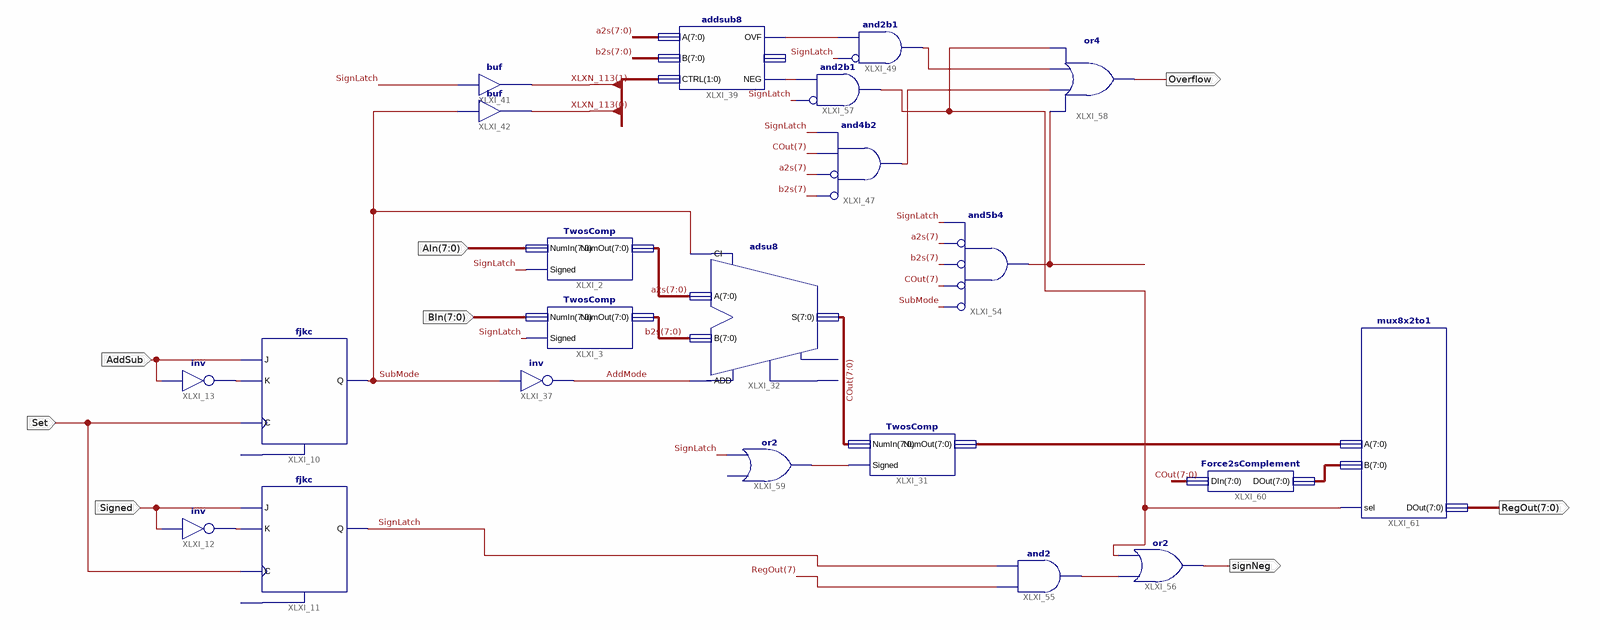
[diagram p0: schematic sheet 1]
// Xilinx ISE schematic AddSub_ALU.sch (spartan3e) as structural Verilog: 22 symbols, 8 ports
module AddSub_ALU (
  input  [7:0] AIn,
  input  [7:0] BIn,
  input  AddSub,
  input  Signed,
  input  Set,
  output signNeg,
  output Overflow,
  output [7:0] RegOut
);

  wire AddMode, SignLatch, SubMode, XLXN_10, XLXN_12, XLXN_122, XLXN_136, XLXN_137, XLXN_160, XLXN_164,
       XLXN_167, XLXN_171, XLXN_174;
  wire [1:0] XLXN_113;
  wire [7:0] a2s, b2s, COut, XLXN_177, XLXN_179;

  TwosComp XLXI_2 (.NumIn(AIn), .NumOut(a2s), .Signed(SignLatch));
  TwosComp XLXI_3 (.NumIn(BIn), .NumOut(b2s), .Signed(SignLatch));
  fjkc XLXI_10 (.C(Set), .J(AddSub), .K(XLXN_10), .Q(SubMode));  // open: CLR
  fjkc XLXI_11 (.C(Set), .J(Signed), .K(XLXN_12), .Q(SignLatch));  // open: CLR
  not XLXI_12 (XLXN_12, Signed);
  not XLXI_13 (XLXN_10, AddSub);
  adsu8 XLXI_32 (.A(a2s), .ADD(AddMode), .B(b2s), .CI(SubMode), .S(COut));  // open: CO, OFL
  TwosComp XLXI_31 (.NumIn(COut), .NumOut(XLXN_177), .Signed(XLXN_171));
  not XLXI_37 (AddMode, SubMode);
  addsub8 XLXI_39 (.A(a2s), .B(b2s), .CTRL(XLXN_113), .NEG(XLXN_167), .OVF(XLXN_137));  // open: C
  buf XLXI_41 (XLXN_113[1], SignLatch);
  buf XLXI_42 (XLXN_113[0], SubMode);
  and XLXI_47 (XLXN_122, ~b2s[7], ~a2s[7], COut[7], SignLatch);  // and4b2
  and XLXI_49 (XLXN_136, ~SignLatch, XLXN_137);  // and2b1
  and XLXI_54 (XLXN_160, ~SubMode, ~COut[7], ~b2s[7], ~a2s[7], SignLatch);  // and5b4
  and XLXI_55 (XLXN_164, RegOut[7], SignLatch);
  or XLXI_56 (signNeg, XLXN_164, XLXN_174);
  and XLXI_57 (XLXN_174, ~SignLatch, XLXN_167);  // and2b1
  or XLXI_58 (Overflow, XLXN_160, XLXN_122, XLXN_136, XLXN_174);
  buf XLXI_59 (XLXN_171, SignLatch);  // or2 open: I0
  Force2sComplement XLXI_60 (.DIn(COut), .DOut(XLXN_179));
  mux8x2to1 XLXI_61 (.A(XLXN_177), .B(XLXN_179), .sel(XLXN_174), .DOut(RegOut));
endmodule
